# Altium schematic sheet DEVICE.SchDoc
size A3; SheetNumber: 5; SheetTotal: 5
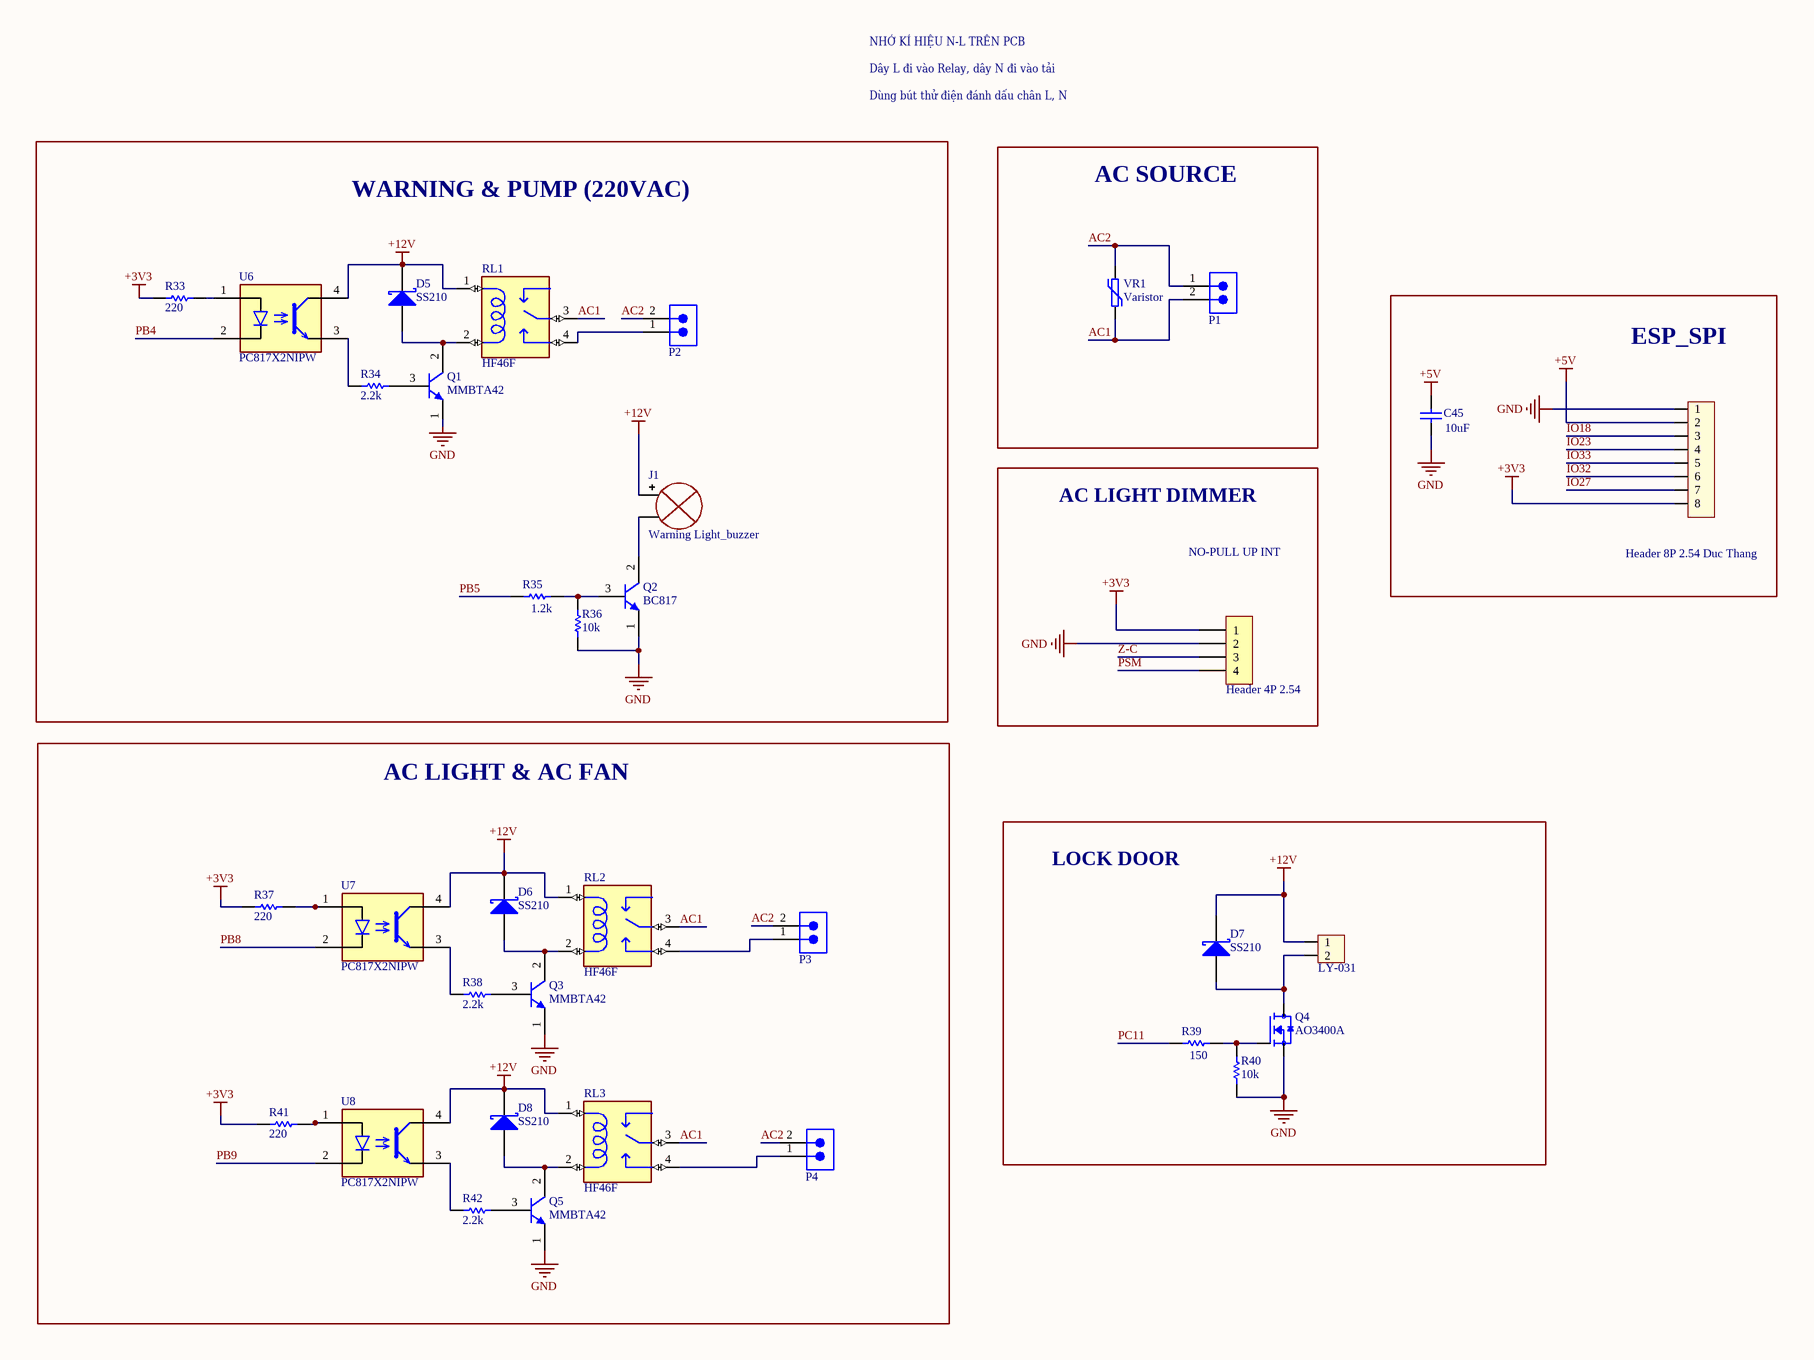
[diagram p0: DEVICE.SchDoc, left]
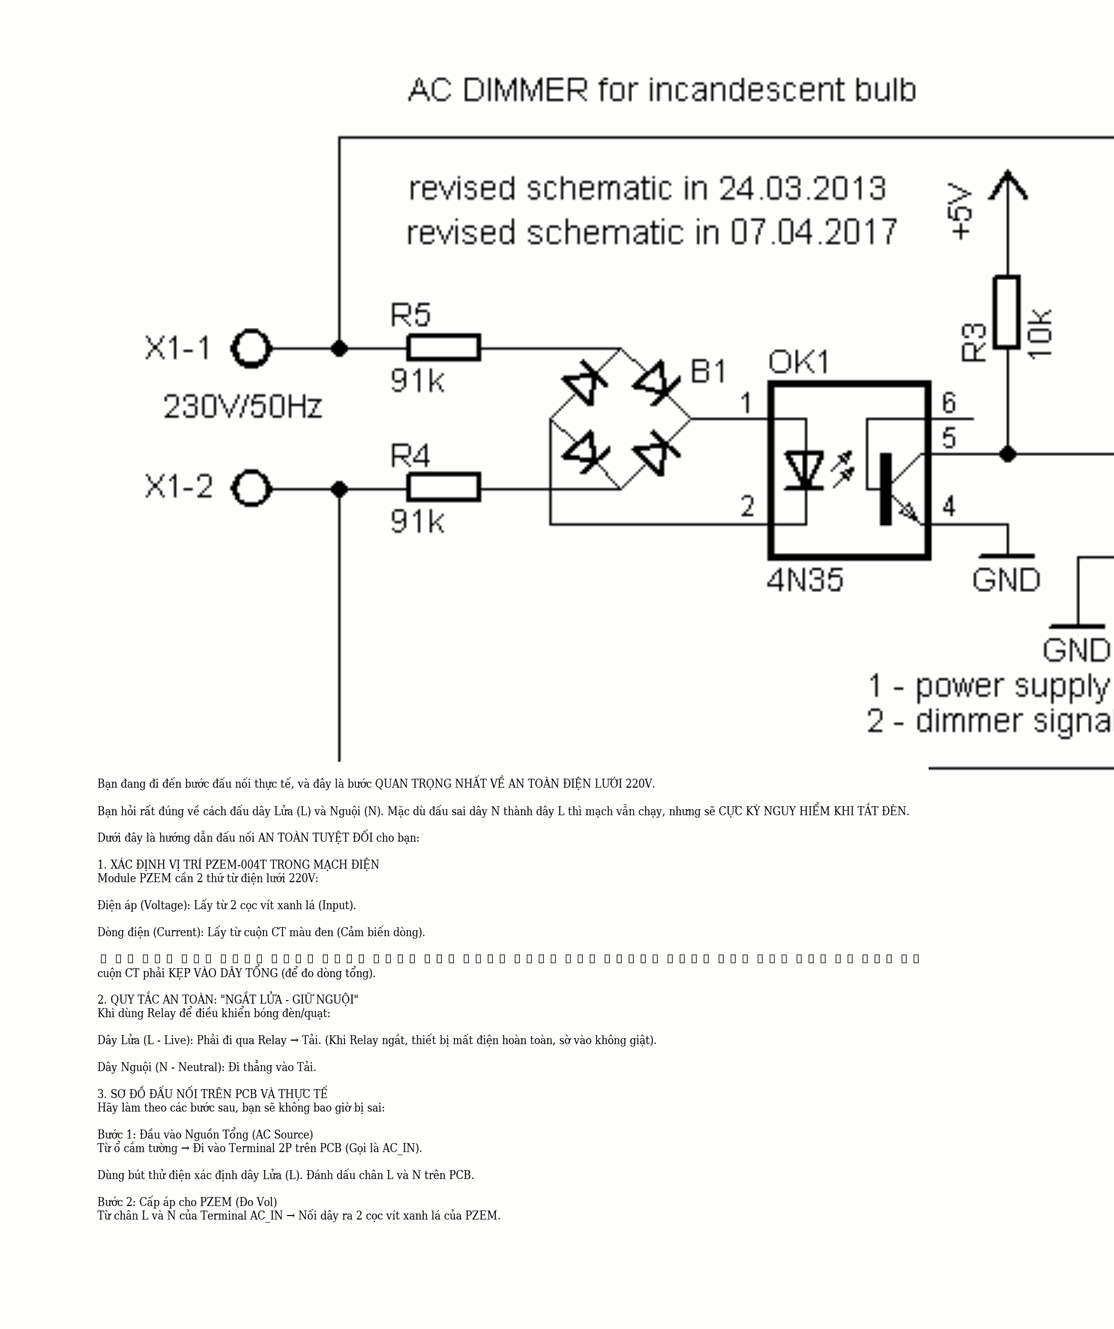
[diagram p1: DEVICE.SchDoc, middle]
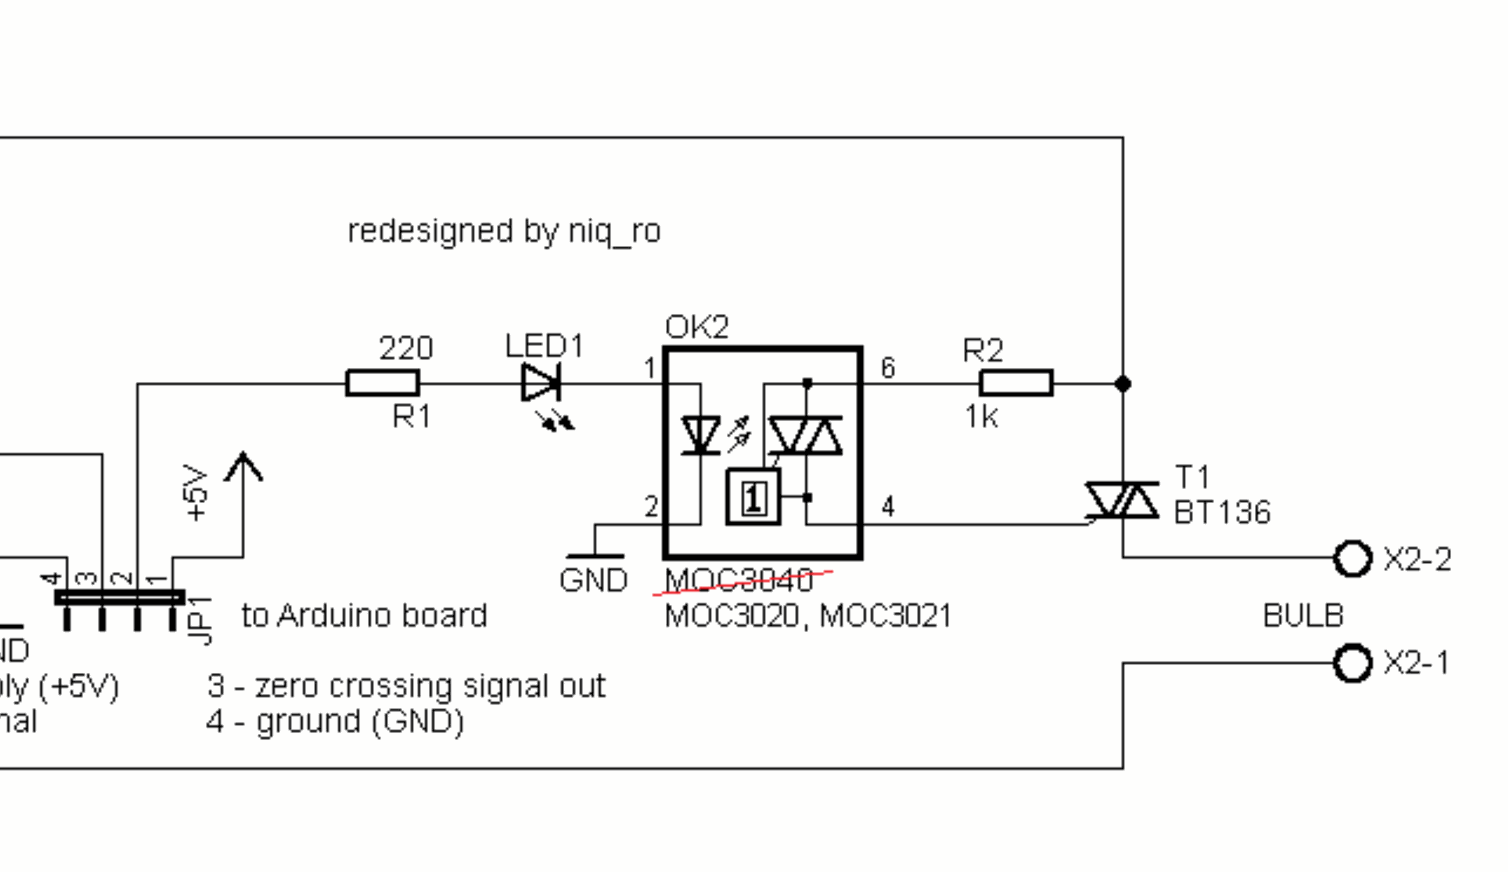
[diagram p2: DEVICE.SchDoc, right]

## Parts
C45  10uF  [CAP_0603]
D5  SS210  [SS34]
D6  SS210  [SS34]
D7  SS210  [SS34]
D8  SS210  [SS34]
H19  Header 8P 2.54 Duc Thang  [XH2.54M-8]
H20  Header 4P 2.54  [XH2.54M-4]
H21  LY-031  [XH2.54M-2]
J1  Warning Light_buzzer  [PHOENIX_1935161]
P1  691322310002  [691322310002]  (value not drawn)
P2  691322310002  [691322310002]  (value not drawn)
P3  691322310002  [691322310002]  (value not drawn)
P4  691322310002  [691322310002]  (value not drawn)
Q1  MMBTA42  [SOT23B]
Q2  BC817  [SOT23B]
Q3  MMBTA42  [SOT23B]
Q4  AO3400A  [SOT95P280X125-3N]
Q5  MMBTA42  [SOT23B]
R33  220  [resistor_0603]
R34  2.2k  [resistor_0603]
R35  1.2k  [resistor_0603]
R36  10k  [resistor_0603]
R37  220  [resistor_0603]
R38  2.2k  [resistor_0603]
R39  150  [resistor_0603]
R40  10k  [resistor_0603]
R41  220  [resistor_0603]
R42  2.2k  [resistor_0603]
RL1  HF46F  [HF46F]
RL2  HF46F  [HF46F]
RL3  HF46F  [HF46F]
U6  PC817X2NIPW  [PC817XI_SHP]
U7  PC817X2NIPW  [PC817XI_SHP]
U8  PC817X2NIPW  [PC817XI_SHP]
VR1  Varistor  [07D471K]

## Blocks framed on the sheet
WARNING & PUMP (220VAC): D5 J1 P2 Q1 Q2 R33-R36 RL1 U6
AC SOURCE: P1 VR1
ESP_SPI: C45 H19
AC LIGHT DIMMER: H20
AC LIGHT & AC FAN: D6 D8 P3 P4 Q3 Q5 R37 R38 R41 R42 RL2 RL3 U7 U8
LOCK DOOR: D7 H21 Q4 R39 R40

## Nets
+3V3: H19.8 H20.1 R33.1 R37.1 R41.1
+5V: C45.2 H19.2
+12V: D5.2(K) D6.2(K) D7.2(K) D8.2(K) H21.1 J1.1(+) RL1.1(C1) RL2.1(C1) RL3.1(C1) U6.4 U7.4 U8.4
GND: C45.1 H19.1 H20.2 Q1.1(E) Q2.1(E) Q3.1(E) Q4.2(S) Q5.1(E) R36.1 R40.1
AC1: P1.2 RL1.3(C) RL2.3(C) RL3.3(C) VR1.2
AC2: P1.1 P2.2 P3.2 P4.2 VR1.1
IO18: H19.3
IO23: H19.4
IO27: H19.7
IO32: H19.6
IO33: H19.5
PB4: U6.2
PB5: R35.1
PB8: U7.2
PB9: U8.2
PC11: R39.1
PSM: H20.4
Z-C: H20.3
NetD5_1: D5.1(A) Q1.2(C) RL1.2(C2)
NetD6_1: D6.1(A) Q3.2(C) RL2.2(C2)
NetD7_1: D7.1(A) H21.2 Q4.3(D)
NetD8_1: D8.1(A) Q5.2(C) RL3.2(C2)
NetJ1_2: J1.2(-) Q2.2(C)
NetP2_1: P2.1 RL1.4(NO)
NetP3_1: P3.1 RL2.4(NO)
NetP4_1: P4.1 RL3.4(NO)
NetQ1_3: Q1.3(B) R34.2
NetQ2_3: Q2.3(B) R35.2 R36.2
NetQ3_3: Q3.3(B) R38.2
NetQ4_1: Q4.1(G) R39.2 R40.2
NetQ5_3: Q5.3(B) R42.2
NetR33_2: R33.2 U6.1
NetR34_1: R34.1 U6.3
NetR37_2: R37.2 U7.1
NetR38_1: R38.1 U7.3
NetR41_2: R41.2 U8.1
NetR42_1: R42.1 U8.3

## Notes on the sheet
- NHỚ KÍ HIỆU N-L TRÊN PCB
- Dây L đi vào Relay, dây N đi vào tải
- Dùng bút thử điện đánh dấu chân L, N
- NO-PULL UP INT
- Bạn đang đi đến bước đấu nối thực tế, và đây là bước QUAN TRỌNG NHẤT VỀ AN TOÀN ĐIỆN LƯỚI 220V.
  Bạn hỏi rất đúng về cách đấu dây Lửa (L) và Nguội (N). Mặc dù đấu sai dây N thành dây L thì mạch vẫn chạy, nhưng sẽ CỰC KỲ NGUY HIỂM KHI TẮT ĐÈN.
  Dưới đây là hướng dẫn đấu nối AN TOÀN TUYỆT ĐỐI cho bạn:
  1. XÁC ĐỊNH VỊ TRÍ PZEM-004T TRONG MẠCH ĐIỆN
  Module PZEM cần 2 thứ từ điện lưới 220V:
  Điện áp (Voltage): Lấy từ 2 cọc vít xanh lá (Input).
  Dòng điện (Current): Lấy từ cuộn CT màu đen (Cảm biến dòng).
  👉 Vị trí lắp đặt: PZEM phải được đấu SONG SONG với nguồn tổng đầu vào (để đo áp) và cuộn CT phải KẸP VÀO DÂY TỔNG (để đo dòng tổng).
  2. QUY TẮC AN TOÀN: "NGẮT LỬA - GIỮ NGUỘI"
  Khi dùng Relay để điều khiển bóng đèn/quạt:
  Dây Lửa (L - Live): Phải đi qua Relay → Tải. (Khi Relay ngắt, thiết bị mất điện hoàn toàn, sờ vào không giật).
  Dây Nguội (N - Neutral): Đi thẳng vào Tải.
  3. SƠ ĐỒ ĐẤU NỐI TRÊN PCB VÀ THỰC TẾ
  Hãy làm theo các bước sau, bạn sẽ không bao giờ bị sai:
  Bước 1: Đầu vào Nguồn Tổng (AC Source)
  Từ ổ cắm tường → Đi vào Terminal 2P trên PCB (Gọi là AC_IN).
  Dùng bút thử điện xác định dây Lửa (L). Đánh dấu chân L và N trên PCB.
  Bước 2: Cấp áp cho PZEM (Đo Vol)
  Từ chân L và N của Terminal AC_IN → Nối dây ra 2 cọc vít xanh lá của PZEM.
  (Lưu ý: PZEM cần đo điện áp nguồn vào, nên nó phải lấy điện TRƯỚC khi đi qua Relay).
  Bước 3: Đo dòng bằng CT (Quan trọng)
  Luồn dây nào? Bạn luồn dây LỬA (L) hay dây NGUỘI (N) qua lỗ cuộn CT đều được. Kết quả đo là như nhau.
  Vị trí luồn:
  Để đo tổng công suất cả nhà: Luồn dây L (hoặc N) từ nguồn tổng đi vào PCB qua lỗ CT.
  Mẹo: Bạn có thể luồn ngay đoạn dây điện nguồn trước khi nó chui vào Terminal AC_IN.
  Bước 4: Đấu Relay (Tải)
  Dây Lửa (L): Từ Terminal AC_IN → Chân COM của Relay.
  Đầu ra Relay: Từ chân NO của Relay → Đi ra bóng đèn.
  Dây Nguội (N): Từ Terminal AC_IN → Đi thẳng ra bóng đèn (Không qua Relay).
- Title:
- Desc:
- Designed by:
- Checked by:
- Date:
- Document No:
- Revision:
- Size:
- A3
- Approved by:
- Sheet
- of

## Library data of the parts
C45 = 01060310010: CAP, size 0603,10uF; Supply 2 name: Thegioiic; Capacitance Tolerance: +/-10%; ComponentLink1Description: Manufacturer; ComponentLink1URL: *; ComponentLink2Description: Datasheet; ComponentLink2URL: *; Operating Temperature: -55 to +125degC; Packaging: Tape and Reel; Supply 1 SN: *; Supply 1 name: *; Supply 1 URL: *; Supply 2 SN: *; Supply 2 URL: https://www.thegioiic.com/tu-gom-0603-10uf-16v; Dissipation Factor: *; Height: *; Mounting Technology: SMT; Size: 0603; Capacitance: 10uF; Technical Reference: *
D5-D8 = D Schottky: Schottky Diode; Published: 8-Jun-2000; LatestRevisionDate: 17-Jul-2002; LatestRevisionNote: Re-released for DXP Platform.; PackageReference: SMB; Publisher: Altium Limited; PackageDescription: DO-214-AA/SMB; 2 C-Bend Leads; Body 5.3 x 3.6 mm, inc. leads (LxW); Code_JEDEC: DO-214-AA
H19 = Header 8P 2.54 Duc Thang: Cắm; Ten_Linh_Kien: Header 8P XH2.54-8P Đực Thẳng; Don_Vi: Con; Ma_Hang: MH003366; Chung_Loai: Cắm
H20 = Header 4P 2.54 Duc Thang: Cắm; Ten_Linh_Kien: Header 4P XH2.54-4P Đực Thẳng; Don_Vi: Con; Ma_Hang: MH001285; Chung_Loai: Cắm
H21 = Header 2P 2.54 Duc Thang: Cắm; Ten_Linh_Kien: Header 2P XH2.54-2P Đực Thẳng; Don_Vi: Con; Ma_Hang: MH001283; Chung_Loai: Cắm
J1 = Light_12V
P1-P4 = 691322310002: WR-TBL Series 322 Horizontal PCB Header, THT, pitch 3.81mm, 2p; Manufacturer: Wurth Elektronik; Modularity: No; Rated Current: 10A; Working Voltage: 300V; Supply 3 Name: ThegioiIC; ComponentLink1Description: Website Link; ComponentLink1URL: https://www.we-online.com/redexpert/article/691322310002?ad; ComponentLink2Description: Datasheet Link; ComponentLink2URL: https://www.we-online.com/redexpert/spec/691322310002?ad; Manufacturer Part Number: 691322310002; Category: Terminal Blocks; Match Code: WR-TBL; Mount: Through Hole; Operating Temperature Max: 105°C; Operating Temperature Min: -40°C; Packaging: Box; Application: Pluggable; Number of Pins: 2; Number of Rows: 1; Orientation: Horizontal; Pitch: 3.81mm; Supply 1 Name: *; Supply 1 SN: *; Supply 1 URL: *; Supply 2 Name: *; Supply 2 SN: *; Supply 2 URL: *; Supply 3 SN: *; Supply 3 URL 1: https://www.thegioiic.com/kf-3-81-2-r-terminal-block-plug-in-han-pcb-2-chan-cong-3-81mm-300v-10a; Supply 3 URL 2: https://www.thegioiic.com/ul-3-81-2-r-terminal-block-plug-in-han-pcb-2-chan-cong-3-81mm-300v-10a-ulo
Q1-Q3 Q5 = BC817: NPN Bipolar Transistor
Q4 = AO3400A: N-Channel 30 V 5.7A (Ta) 1.4W (Ta) Surface Mount SOT-23-3; MF: Alpha & Omega Semiconductor; SnapEDA_Link: https://www.snapeda.com/parts/AO3400A/Alpha/view-part/?ref=snap; Package: SOT-23 Alpha &amp; Omega Semiconductor Inc.; Value: *; MP: AO3400A; Check_prices: https://www.snapeda.com/parts/AO3400A/Alpha/view-part/?ref=eda
R33 R37 R41 = 0006032211: RES, 220 Ohm, size 0603, 1%; Resistance Tolerant: +/-1%; Rated Power: 1/4W; Supply 1 Name: Mouser; Supply 1 SN: 667-ERJ-UP3F2200V; Supply 2 Name: Digikey; Supply 2 SN: 10-ERJ-UP3F2200VTR-ND 10-ERJ-UP3F2200VCT-ND 10-ERJ-UP3F2200VDKR-ND; Resistance: 220; Size: 0603; Mounting Technology: SMT; ComponentLink1Description: Datasheet link; ComponentLink1URL: https://api.pim.na.industrial.panasonic.com/file_stream/main/fileversion/4484; ComponentLink2Description: Supply 1 URL; ComponentLink2URL: https://www.mouser.vn/ProductDetail/Panasonic/ERJ-UP3F2200V?qs=sGAEpiMZZMvdGkrng054twq3eZrCFN89E%252BhCXuCu3h8RslmTO1I28Q%3D%3D; ComponentLink3Description: Supply 2 URL; ComponentLink3URL: https://www.digikey.com/en/products/detail/panasonic-electronic-components/ERJ-UP3F2200V/12092129
R34 R38 R42 = 0006032221: RES, 2.2k Ohm, size 0603, 1%; Resistance Tolerant: +/-1%; Rated Power: 1/4W; Supply 1 Name: Mouser; Supply 1 SN: 667-ERJ-UP3F2201V; Supply 2 Name: Digikey; Supply 2 SN: 10-ERJ-UP3F2201VTR-ND 10-ERJ-UP3F2201VCT-ND 10-ERJ-UP3F2201VDKR-ND; Supply 3 Name: thegioiic; Supply 3 SN: NA; Resistance: 2.2k; Size: 0603; Mounting Technology: SMT; ComponentLink1Description: Datasheet link; ComponentLink1URL: https://api.pim.na.industrial.panasonic.com/file_stream/main/fileversion/4484; ComponentLink2Description: Supply 1 URL; ComponentLink2URL: https://www.mouser.vn/ProductDetail/Panasonic/ERJ-UP3F2201V?qs=sGAEpiMZZMvdGkrng054twq3eZrCFN89KeaXYJ5LTWyJgfuuVVfZrw%3D%3D; ComponentLink3Description: Supply 2 URL; ComponentLink3URL: https://www.digikey.com/en/products/detail/panasonic-electronic-components/ERJ-UP3F2201V/12092708; ComponentLink4Description: Supply 3 URL; ComponentLink4URL: https://www.thegioiic.com/dien-tro-2-2-kohm-0603-1
R35 = 0006032221: RES, 1.2k Ohm, size 0603, 1%; Resistance: 2.2k; Resistance Tolerant: +/-1%; Rated Power: 1/4W; Supply 1 Name: Mouser; Supply 1 SN: 667-ERJ-UP3F2201V; Supply 2 Name: Digikey; Supply 2 SN: 10-ERJ-UP3F2201VTR-ND 10-ERJ-UP3F2201VCT-ND 10-ERJ-UP3F2201VDKR-ND; Supply 3 Name: thegioiic; Supply 3 SN: NA; Size: 0603; Mounting Technology: SMT; ComponentLink1Description: Datasheet link; ComponentLink1URL: https://api.pim.na.industrial.panasonic.com/file_stream/main/fileversion/4484; ComponentLink2Description: Supply 1 URL; ComponentLink2URL: https://www.mouser.vn/ProductDetail/Panasonic/ERJ-UP3F2201V?qs=sGAEpiMZZMvdGkrng054twq3eZrCFN89KeaXYJ5LTWyJgfuuVVfZrw%3D%3D; ComponentLink3Description: Supply 2 URL; ComponentLink3URL: https://www.digikey.com/en/products/detail/panasonic-electronic-components/ERJ-UP3F2201V/12092708; ComponentLink4Description: Supply 3 URL; ComponentLink4URL: https://www.thegioiic.com/dien-tro-2-2-kohm-0603-1
R36 R40 = 0006032221: RES, 10k Ohm, size 0603, 1%; Resistance: 2.2k; Resistance Tolerant: +/-1%; Rated Power: 1/4W; Supply 1 Name: Mouser; Supply 1 SN: 667-ERJ-UP3F2201V; Supply 2 Name: Digikey; Supply 2 SN: 10-ERJ-UP3F2201VTR-ND 10-ERJ-UP3F2201VCT-ND 10-ERJ-UP3F2201VDKR-ND; Supply 3 Name: thegioiic; Supply 3 SN: NA; Size: 0603; Mounting Technology: SMT; ComponentLink1Description: Datasheet link; ComponentLink1URL: https://api.pim.na.industrial.panasonic.com/file_stream/main/fileversion/4484; ComponentLink2Description: Supply 1 URL; ComponentLink2URL: https://www.mouser.vn/ProductDetail/Panasonic/ERJ-UP3F2201V?qs=sGAEpiMZZMvdGkrng054twq3eZrCFN89KeaXYJ5LTWyJgfuuVVfZrw%3D%3D; ComponentLink3Description: Supply 2 URL; ComponentLink3URL: https://www.digikey.com/en/products/detail/panasonic-electronic-components/ERJ-UP3F2201V/12092708; ComponentLink4Description: Supply 3 URL; ComponentLink4URL: https://www.thegioiic.com/dien-tro-2-2-kohm-0603-1
R39 = 0006032221: RES, 150 Ohm, size 0603, 1%; Resistance: 2.2k; Resistance Tolerant: +/-1%; Rated Power: 1/4W; Supply 1 Name: Mouser; Supply 1 SN: 667-ERJ-UP3F2201V; Supply 2 Name: Digikey; Supply 2 SN: 10-ERJ-UP3F2201VTR-ND 10-ERJ-UP3F2201VCT-ND 10-ERJ-UP3F2201VDKR-ND; Supply 3 Name: thegioiic; Supply 3 SN: NA; Size: 0603; Mounting Technology: SMT; ComponentLink1Description: Datasheet link; ComponentLink1URL: https://api.pim.na.industrial.panasonic.com/file_stream/main/fileversion/4484; ComponentLink2Description: Supply 1 URL; ComponentLink2URL: https://www.mouser.vn/ProductDetail/Panasonic/ERJ-UP3F2201V?qs=sGAEpiMZZMvdGkrng054twq3eZrCFN89KeaXYJ5LTWyJgfuuVVfZrw%3D%3D; ComponentLink3Description: Supply 2 URL; ComponentLink3URL: https://www.digikey.com/en/products/detail/panasonic-electronic-components/ERJ-UP3F2201V/12092708; ComponentLink4Description: Supply 3 URL; ComponentLink4URL: https://www.thegioiic.com/dien-tro-2-2-kohm-0603-1
RL1-RL3 = HF46F: SeriesHF46F 12V 1 Form A 1A Gold Plated SUBMINIATURE INTERMEDIATE POWER RELAY; MF: Hongfa; Package: None; Price: None; Value: *; SnapEDA_Link: https://www.snapeda.com/parts/HF46F/Hongfa/view-part/?ref=snap; MP: HF46F; Availability: Not in stock; Check_prices: https://www.snapeda.com/parts/HF46F/Hongfa/view-part/?ref=eda
U6-U8 = PC817X2NIPW: PC817 series, SMD, I_F (max) = 500mA, V_F (max) = 1.4V. / Breakdown voltage: BV_CE = 80V, BV_BE = 6V.
VR1 = 07D471K 470V